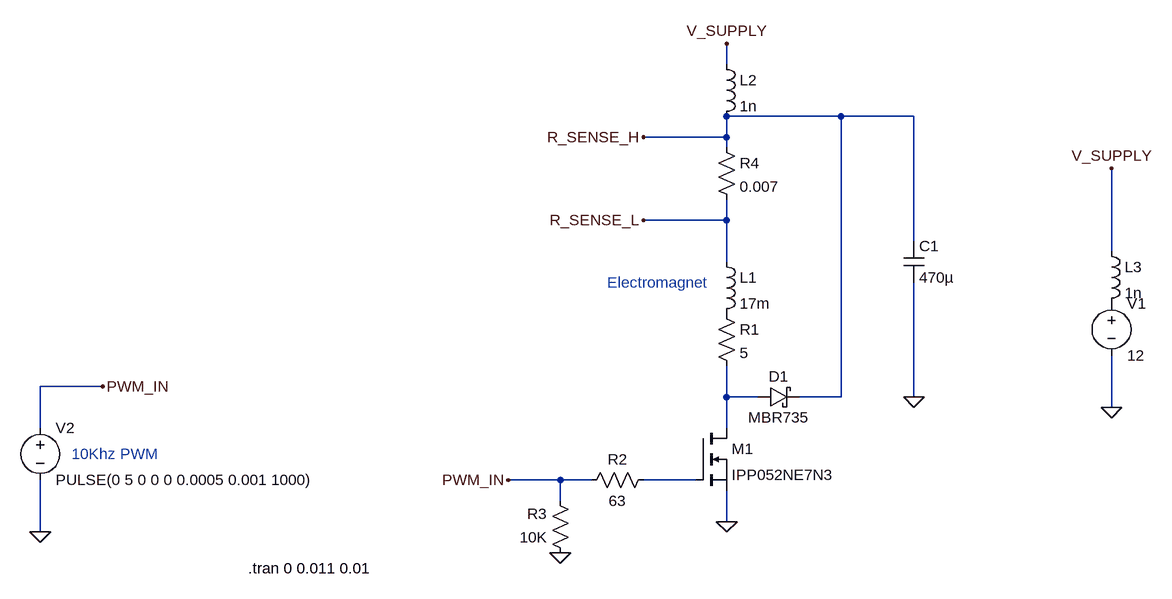
[diagram p0: schematic PWMMFETSimulation.asc]
PWMMFETSimulation.asc, the LTspice schematic file:
Version 4
SHEET 1 1004 680
WIRE 176 -432 176 -464
WIRE 352 -352 176 -352
WIRE 464 -352 352 -352
WIRE 176 -320 176 -352
WIRE 176 -320 48 -320
WIRE 176 -304 176 -320
WIRE 176 -192 176 -224
WIRE 176 -192 48 -192
WIRE 464 -160 464 -352
WIRE 768 -144 768 -272
WIRE 176 -128 176 -192
WIRE -784 64 -880 64
WIRE 176 80 176 32
WIRE 224 80 176 80
WIRE 352 80 352 -352
WIRE 352 80 288 80
WIRE 464 80 464 -96
WIRE 768 96 768 16
WIRE -880 128 -880 64
WIRE 176 128 176 80
WIRE -80 208 -160 208
WIRE -32 208 -80 208
WIRE 128 208 48 208
WIRE -80 240 -80 208
WIRE 176 272 176 224
WIRE -880 288 -880 208
FLAG 768 96 0
FLAG 176 272 0
FLAG 176 -464 V_SUPPLY
FLAG 768 -272 V_SUPPLY
FLAG -80 320 0
FLAG -160 208 PWM_IN
FLAG 48 -320 R_SENSE_H
FLAG 48 -192 R_SENSE_L
FLAG -880 288 0
FLAG -784 64 PWM_IN
FLAG 464 80 0
SYMBOL nmos 128 128 R0
SYMATTR InstName M1
SYMATTR Value IPP052NE7N3
SYMBOL res 160 -64 R0
SYMATTR InstName R1
SYMATTR Value 5
SYMBOL ind 160 -144 R0
SYMATTR InstName L1
SYMATTR Value 17m
SYMBOL schottky 224 96 R270
WINDOW 0 32 32 VTop 2
WINDOW 3 0 32 VBottom 2
SYMATTR InstName D1
SYMATTR Value MBR735
SYMATTR Description Diode
SYMATTR Type diode
SYMBOL voltage 768 -80 R0
WINDOW 123 0 0 Left 0
WINDOW 39 0 0 Left 0
SYMATTR InstName V1
SYMATTR Value 12
SYMBOL res 64 192 R90
WINDOW 0 0 56 VBottom 2
WINDOW 3 32 56 VTop 2
SYMATTR InstName R2
SYMATTR Value 63
SYMBOL res -64 336 R180
WINDOW 0 36 76 Left 2
WINDOW 3 36 40 Left 2
SYMATTR InstName R3
SYMATTR Value 10K
SYMBOL voltage -880 112 R0
WINDOW 123 0 0 Left 0
WINDOW 39 0 0 Left 0
SYMATTR InstName V2
SYMATTR Value PULSE(0 5 0 0 0 0.0005 0.001 1000)
SYMBOL res 160 -320 R0
SYMATTR InstName R4
SYMATTR Value 0.007
SYMBOL ind 752 -160 R0
SYMATTR InstName L3
SYMATTR Value 1n
SYMBOL cap 448 -160 R0
SYMATTR InstName C1
SYMATTR Value 470µ
SYMBOL ind 160 -448 R0
SYMATTR InstName L2
SYMATTR Value 1n
TEXT -8 -96 Left 2 ;Electromagnet
TEXT -832 168 Left 2 ;10Khz PWM
TEXT -560 344 Left 2 !.tran 0 0.011 0.01

The netlist it stands for:
* PWMMFETSimulation.asc
M1 N001 N002 0 0 IPP052NE7N3
R1 P001 N001 5
L1 R_SENSE_L P001 17m
D1 N001 R_SENSE_H MBR735
V1 P002 0 12
R2 N002 PWM_IN 63
R3 0 PWM_IN 10K
V2 PWM_IN 0 PULSE(0 5 0 0 0 0.0005 0.001 1000)
R4 R_SENSE_H R_SENSE_L 0.007
L3 V_SUPPLY P002 1n
C1 R_SENSE_H 0 470µ
L2 V_SUPPLY R_SENSE_H 1n
.model D D
.lib standard.dio
.model NMOS NMOS
.model PMOS PMOS
.lib standard.mos
* Electromagnet
* 10Khz PWM
.tran 0 0.011 0.01
.backanno
.end